# EAGLE schematic liron (EAGLE 6.6.0)
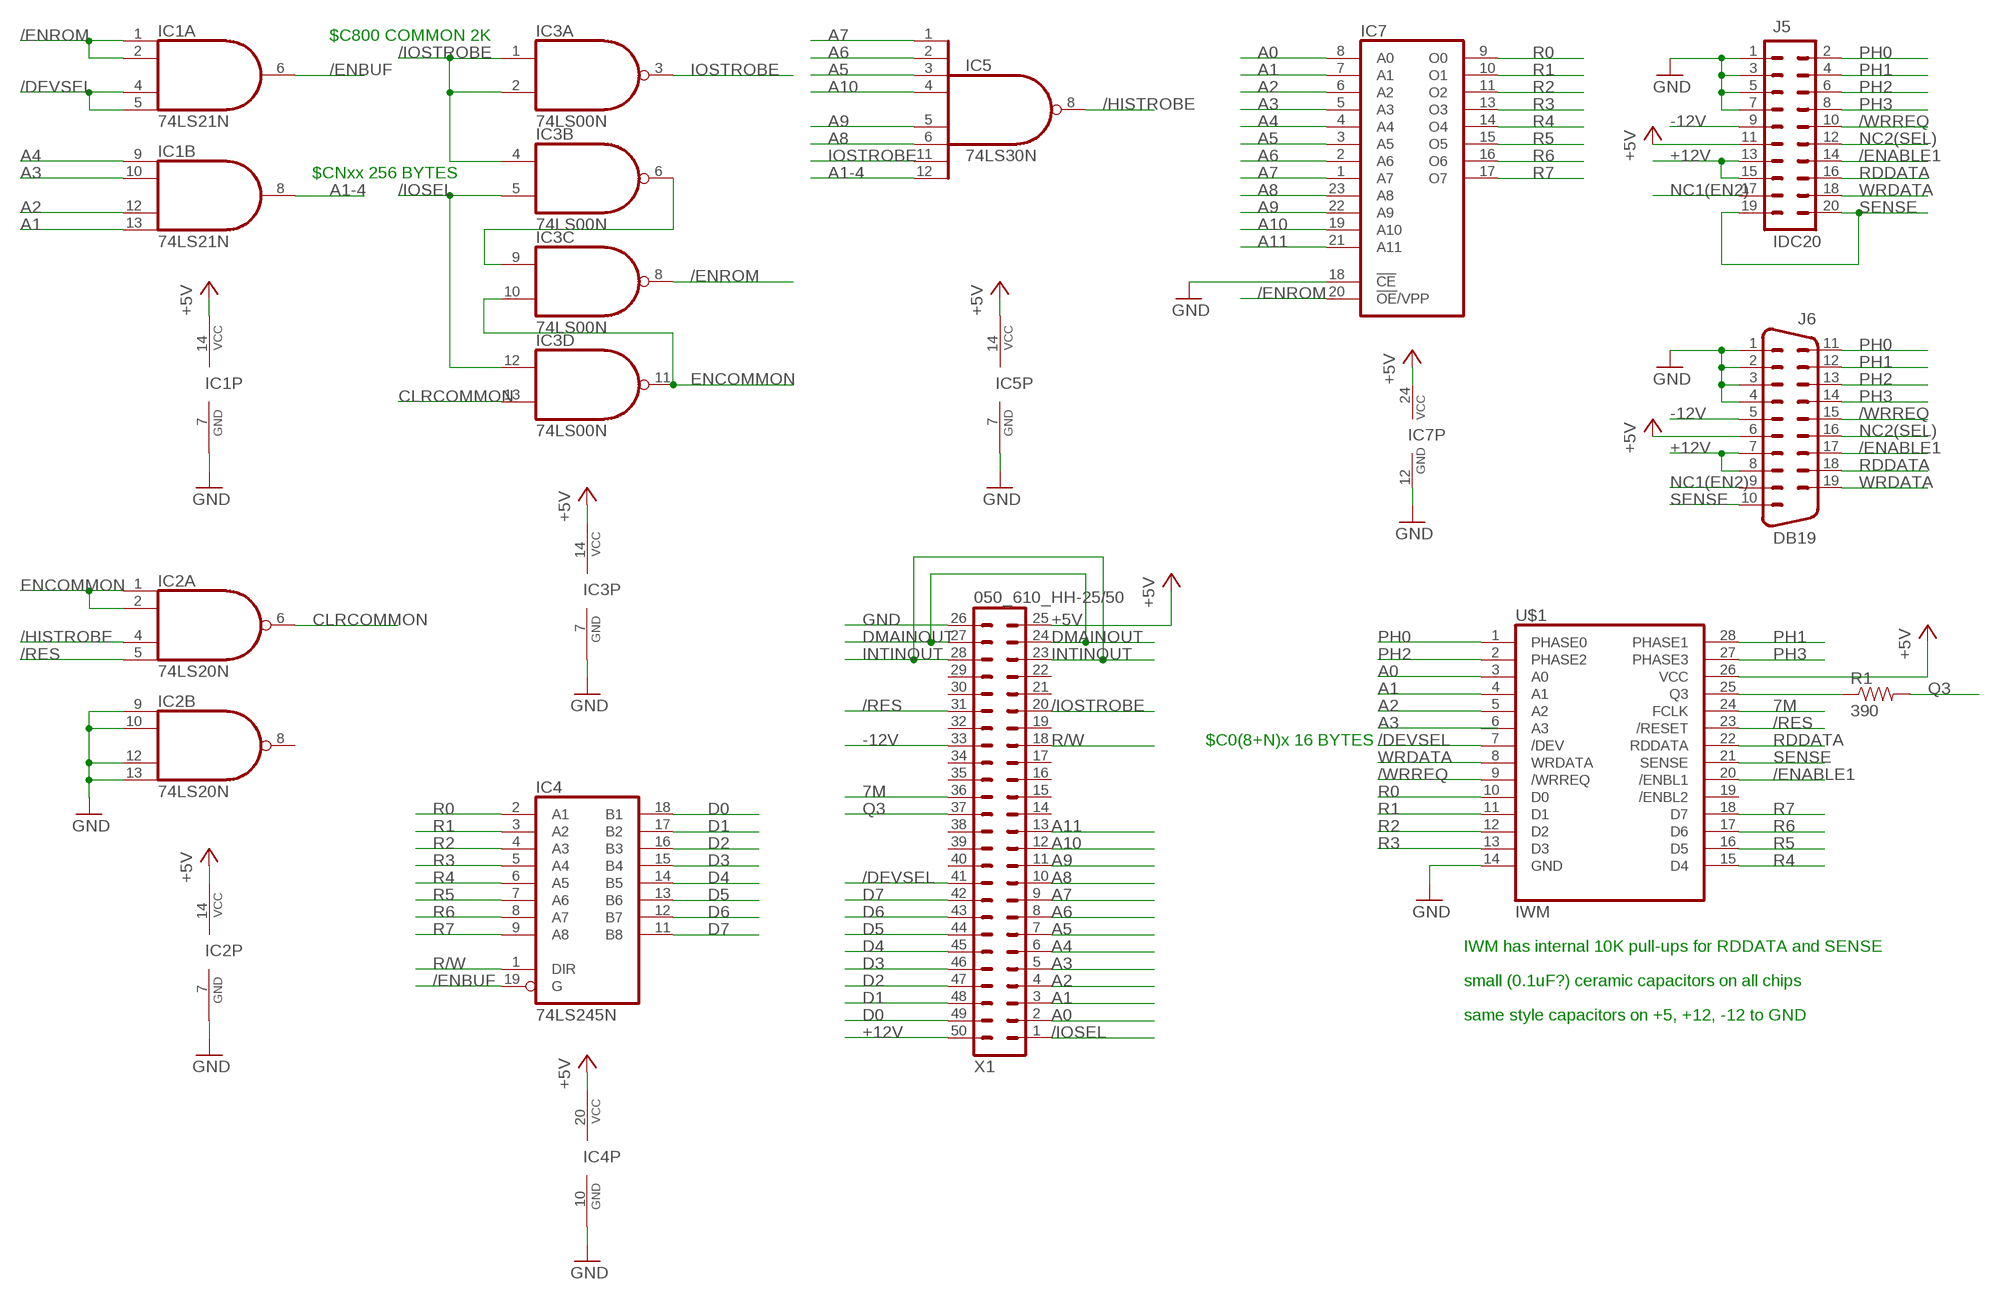
[diagram p0: schematic, sheet 1]

## Parts
IC1  74LS21N  [DIL14]
IC2  74LS20N  [DIL14]
IC3  74LS00N  [DIL14]
IC4  74LS245N  [DIL20]
IC5  74LS30N  [DIL14]
IC7  2732  [DIL24]
J5  IDC20  [IDC20]
J6  DB19  DB19EDGE  [DB19EDGE]
R1  390  RESISTOR0805-RES  [0805]
U$1  IWM  [DIL28]
X1  050_610_HH-25/50  [050_610_HH-25/50]

## Nets
7M: U$1.24(FCLK) X1.36
+5V: IC1.14(P:VCC) IC2.14(P:VCC) IC3.14(P:VCC) IC4.20(VCC) IC5.14(VCC) IC7.24(VCC) J5.11 J6.6 U$1.26(VCC) X1.25
+12V: J5.13 J5.15 J6.7 J6.8 X1.50
-12V: J5.9 J6.5 X1.33
/DEVSEL: IC1.4(A:I2) IC1.5(A:I3) U$1.7(/DEV) X1.41
/ENABLE1: J5.14 J6.17 U$1.20(/ENBL1)
/ENBUF: IC1.6(A:O) IC4.19(G)
/ENROM: IC1.1(A:I0) IC1.2(A:I1) IC3.8(C:O) IC7.20(!OE!/VPP)
/HISTROBE: IC2.4(A:I2) IC5.8(O)
/IOSEL: IC3.5(B:I1) IC3.12(D:I0) X1.1
/IOSTROBE: IC3.1(A:I0) IC3.2(A:I1) IC3.4(B:I0) X1.20
/RES: IC2.5(A:I3) U$1.23(/RESET) X1.31
/WRREQ: J5.10 J6.15 U$1.9(/WRREQ)
A0: IC7.8(A0) U$1.3(A0) X1.2
A1: IC1.13(B:I3) IC7.7(A1) U$1.4(A1) X1.3
A1-4: IC1.8(B:O) IC5.12(I7)
A2: IC1.12(B:I2) IC7.6(A2) U$1.5(A2) X1.4
A3: IC1.10(B:I1) IC7.5(A3) X1.5
A4: IC1.9(B:I0) IC7.4(A4) X1.6
A5: IC5.3(I2) IC7.3(A5) X1.7
A6: IC5.2(I1) IC7.2(A6) X1.8
A7: IC5.1(I0) IC7.1(A7) X1.9
A8: IC5.6(I5) IC7.23(A8) X1.10
A9: IC5.5(I4) IC7.22(A9) X1.11
A10: IC5.4(I3) IC7.19(A10) X1.12
A11: IC7.21(A11) X1.13
CLRCOMMON: IC2.6(A:O) IC3.13(D:I1)
D0: IC4.18(B1) X1.49
D1: IC4.17(B2) X1.48
D2: IC4.16(B3) X1.47
D3: IC4.15(B4) X1.46
D4: IC4.14(B5) X1.45
D5: IC4.13(B6) X1.44
D6: IC4.12(B7) X1.43
D7: IC4.11(B8) X1.42
DMAINOUT: X1.24 X1.27
ENCOMMON: IC2.1(A:I0) IC2.2(A:I1) IC3.10(C:I1) IC3.11(D:O)
GND: IC1.7(P:GND) IC2.7(P:GND) IC2.9(B:I0) IC2.10(B:I1) IC2.12(B:I2) IC2.13(B:I3) IC3.7(P:GND) IC4.10(GND) IC5.7(GND) IC7.12(GND) IC7.18(!CE) J5.1 J5.3 J5.5 J5.7 J6.1 J6.2 J6.3 J6.4 U$1.14(GND) X1.26
INTINOUT: X1.23 X1.28
IOSTROBE: IC3.3(A:O) IC5.11(I6)
N$1: IC3.6(B:O) IC3.9(C:I0)
N$2: R1.1 U$1.25(Q3)
NC1(EN2): J5.17 J6.9
NC2(SEL): J5.12 J6.16
PH0: J5.2 J6.11 U$1.1(PHASE0)
PH1: J5.4 J6.12 U$1.28(PHASE1)
PH2: J5.6 J6.13 U$1.2(PHASE2)
PH3: J5.8 J6.14 U$1.27(PHASE3)
Q3: R1.2 X1.37
R0: IC4.2(A1) IC7.9(O0) U$1.10(D0)
R1: IC4.3(A2) IC7.10(O1) U$1.11(D1)
R2: IC4.4(A3) IC7.11(O2) U$1.12(D2)
R3: IC4.5(A4) IC7.13(O3) U$1.13(D3)
R4: IC4.6(A5) IC7.14(O4) U$1.15(D4)
R5: IC4.7(A6) IC7.15(O5) U$1.16(D5)
R6: IC4.8(A7) IC7.16(O6) U$1.17(D6)
R7: IC4.9(A8) IC7.17(O7) U$1.18(D7)
R/W: IC4.1(DIR) X1.18
RDDATA: J5.16 J6.18 U$1.22(RDDATA)
SENSE: J5.19 J5.20 J6.10 U$1.21(SENSE)
WRDATA: J5.18 J6.19 U$1.8(WRDATA)
Unconnected: IC2.8(B:O) U$1.6(A3) U$1.19(/ENBL2) X1.14 X1.15 X1.16 X1.17 X1.19 X1.21 X1.22 X1.29 X1.30 X1.32 X1.34 X1.35 X1.38 X1.39 X1.40

## Notes on the sheet
- $C800 COMMON 2K
- $CNxx 256 BYTES
- $C0(8+N)x 16 BYTES
- IWM has internal 10K pull-ups for RDDATA and SENSE
- small (0.1uF?) ceramic capacitors on all chips
- same style capacitors on +5, +12, -12 to GND

## Library data of the parts
IC1 = 74xx-us:74*21: Dual 4-input AND gate
IC2 = 74xx-us:74*20: Dual 4-input NAND gate
IC3 = 74xx-us:74*00: Quad 2-input NAND gate
IC4 = 74xx-us:74*245: Octal BUS TRANSCEIVER, 3-state
IC5 = 74xx-us:74*30: 8-input NAND gate
IC7 = memory:2732: MEMORY
J5 = big-mess-o-wires:IDC20
J6 = big-mess-o-wires:DB19: SUB-D
R1 = SparkFun:RESISTOR: Resistor Basic schematic elements and footprints for 0603, 1206, and PTH resistors.
U$1 = liron:IWM
X1 = liron:050_610_?-25/50: .050 DIP EDGE CARD CONNECTOR .050 [1.27mm] CONTACT CENTERS .610" INSULATEOR HEIGHT Source: .050 DIP EDGE CARD.pdf; OC_FARNELL: unknown; OC_NEWARK: unknown